# Altium schematic sheet Power.SchDoc
size A3; SheetNumber: 2; SheetTotal: 8; SheetName: Power
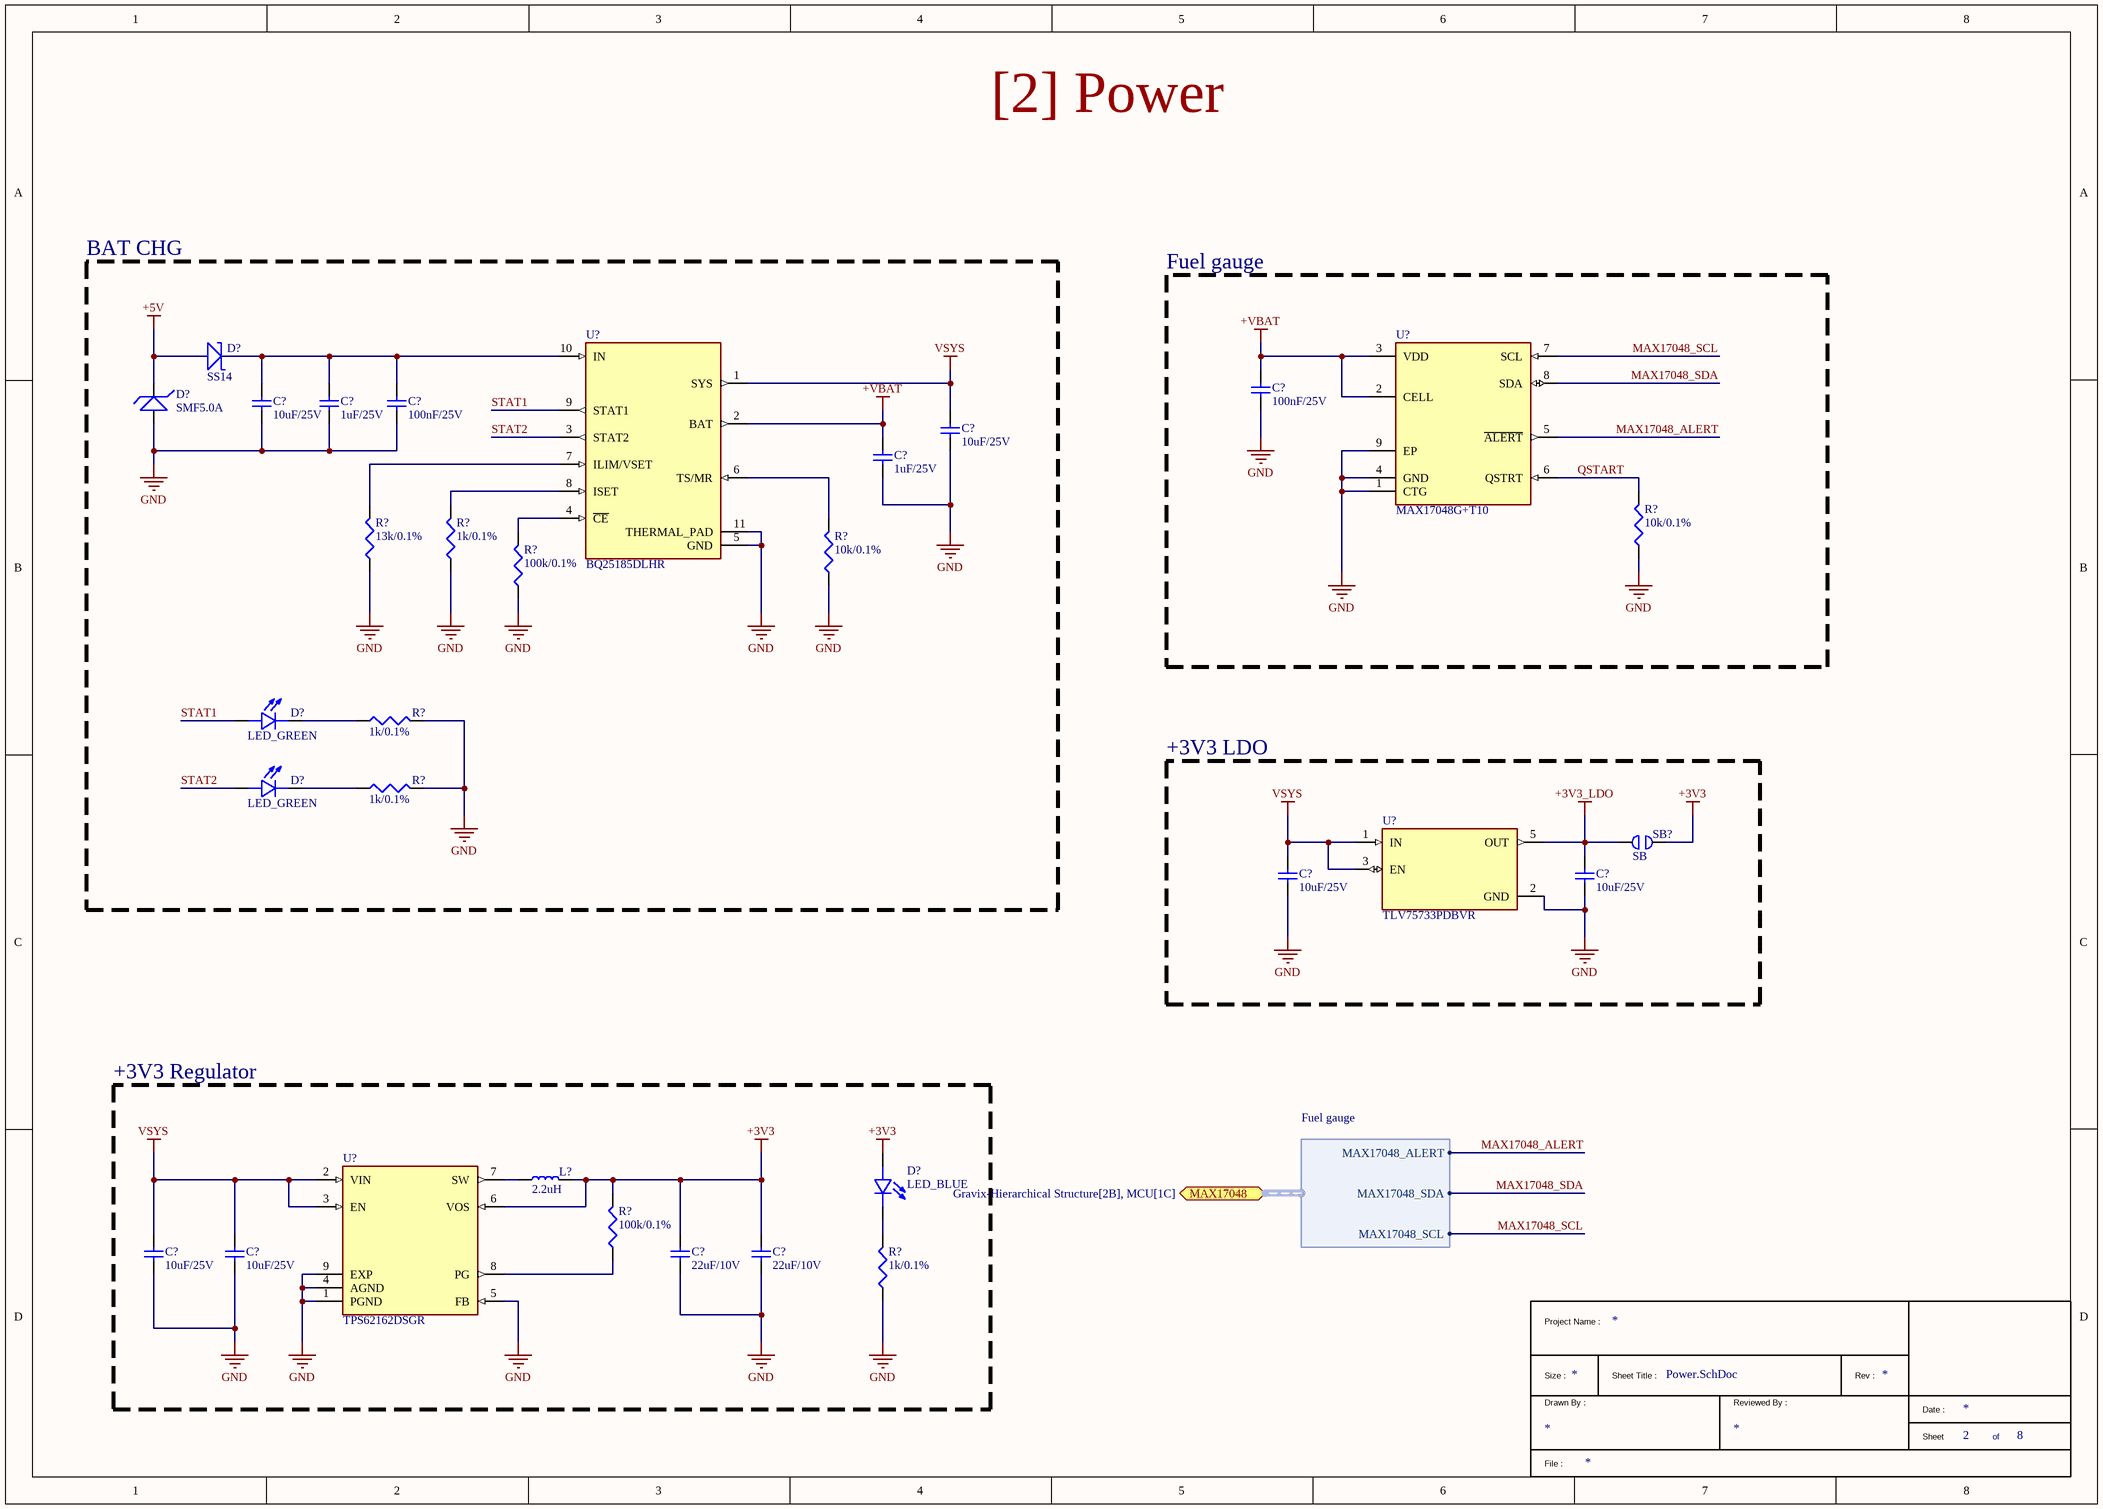
[diagram p0: Power.SchDoc]

## Parts
(Parts that share a designator on the sheet are numbered #1, #2 ... from top to bottom, then left to right.)
*  TitleBlock1  (value not drawn)  (graphical)
C?#1  100nF/25V  [CAP_0402]
C?#2  10uF/25V  [CAP_1206]
C?#3  1uF/25V  [CAP_0805]
C?#4  100nF/25V  [CAP_0402]
C?#5  10uF/25V  [CAP_1206]
C?#6  1uF/25V  [CAP_0805]
C?#7  10uF/25V  [CAP_1206]
C?#8  10uF/25V  [CAP_1206]
C?#9  10uF/25V  [CAP_1206]
C?#10  10uF/25V  [CAP_1206]
C?#11  22uF/10V  [CAP_1206]
C?#12  22uF/10V  [CAP_1206]
D?#1  SS14  [SS14_SMA(DO-214AC)]
D?#2  SMF5.0A  [SMF5.0A_]
D?#3  LED_GREEN  [LED_0402]
D?#4  LED_GREEN  [LED_0402]
D?#5  LED_BLUE  [LED_0402]
L?  2.2uH  [IND_SMD,3x3mm]
R?#1  10k/0.1%  [RES_0402]
R?#2  13k/0.1%  [RES_0402]
R?#3  1k/0.1%  [RES_0402]
R?#4  10k/0.1%  [RES_0402]
R?#5  100k/0.1%  [RES_0402]
R?#6  1k/0.1%  [RES_0402]
R?#7  1k/0.1%  [RES_0402]
R?#8  100k/0.1%  [RES_0402]
R?#9  1k/0.1%  [RES_0402]
SB?  SB  [SLD_2P]
U?#1  MAX17048G+T10  [MAX17048G+T10_TDFN-8]
U?#2  BQ25185DLHR  [BQ25185DLHR_WFDFN-10]
U?#3  TLV75733PDBVR  [TLV75733PDBVR_SOT-23-5]
U?#4  TPS62162DSGR  [TPS62162DSGR_WSON-8-EP(2x2)]

## Blocks framed on the sheet
BAT CHG: C?#2-C?#6 D?#1-D?#4 R?#2-R?#7 U?#2
Fuel gauge: C?#1 R?#1 U?#1
+3V3 LDO: C?#7 C?#8 SB? U?#3
+3V3 Regulator: C?#9-C?#12 D?#5 L? R?#8 R?#9 U?#4

## Ports
MAX17048 (bidir, harness Fuel gauge, see Gravix-Hierarchical Structure[2B], MCU[1C])

## Harnesses
Fuel gauge: MAX17048_SCL, MAX17048_SDA, MAX17048_ALERT

## Nets
+3V3: C?#11.2 C?#12.2 D?#5.A L?.2 R?#8.2 SB?.2 U?#4.6(VOS)
+3V3_LDO: C?#8.2 SB?.1 U?#3.5(OUT)
+5V: D?#1.2
+VBAT: C?#1.2 C?#6.2 U?#1.2(CELL) U?#1.3(VDD) U?#2.2(BAT)
GND: C?#1.1 C?#2.1 C?#3.1 C?#4.1 C?#5.1 C?#6.1 C?#7.1 C?#8.1 C?#9.1 C?#10.1 C?#11.1 C?#12.1 R?#1.1 R?#2.1 R?#3.1 R?#4.1 R?#5.1 R?#6.2 R?#7.2 R?#9.1 U?#1.1(CTG) U?#1.4(GND) U?#1.9(EP) U?#2.5(GND) U?#2.11(THERMAL_PAD) U?#3.2(GND) U?#4.1(PGND) U?#4.4(AGND) U?#4.5(FB) U?#4.9(EXP)
VSYS: C?#5.2 C?#7.2 C?#9.2 C?#10.2 U?#2.1(SYS) U?#3.1(IN) U?#3.3(EN) U?#4.2(VIN) U?#4.3(EN)
MAX17048_ALERT: U?#1.5(~{ALERT}) ; port MAX17048.MAX17048_ALERT
MAX17048_SCL: U?#1.7(SCL) ; port MAX17048.MAX17048_SCL
MAX17048_SDA: U?#1.8(SDA) ; port MAX17048.MAX17048_SDA
QSTART: R?#1.2 U?#1.6(QSTRT)
STAT1: D?#3.A U?#2.9(STAT1)
STAT2: D?#4.A U?#2.3(STAT2)
NetC?#2_2: C?#2.2 C?#3.2 C?#4.2 D?#1.1 U?#2.10(IN)
NetD?#3_C: D?#3.C R?#6.1
NetD?#4_C: D?#4.C R?#7.1
NetD?#5_C: D?#5.C R?#9.2
NetL?_1: L?.1 U?#4.7(SW)
NetR?#2_2: R?#2.2 U?#2.7(ILIM/VSET)
NetR?#3_2: R?#3.2 U?#2.8(ISET)
NetR?#4_2: R?#4.2 U?#2.6(TS/MR)
NetR?#5_2: R?#5.2 U?#2.4(~{CE})
NetR?#8_1: R?#8.1 U?#4.8(PG)

Not connected (* = marked no-connect by the designer): D?#2 1 2

## Notes on the sheet
- [2] Power
- (in symbol TitleBlock1) Project Name :; Size :; Sheet Title :; Rev :; Drawn By :; Reviewed By :; Date :; Sheet; of; File :

## Library data of the parts
C?#1 C?#4 = YAGEO CC0402JRX7R8BB104: 100nF ±5% 25V Ceramic Capacitor X7R 0402; Manufacturer: YAGEO; Manufacturer Part Number: CC0402JRX7R8BB104; LCSC Part Number: C541465; Package: 0402; Mounting Type: SMD; ComponentLink2Description: Digikey Link; ComponentLink3Description: LCSC Link; ComponentLink3URL: https://www.lcsc.com/product-detail/C541465.html?spm=wm.fly.bg.0.xh___wm.fly.dhl.mly.12-0-4&lcsc_vid=QlAIX1RQQQJfX1VRTwcNAQJXTlRaUQBVEQBYAwJfFFcxVlNRQFhYU1xWRFVdXztW
C?#2 C?#5 C?#7-C?#10 = muRata GRM31CR71E106KA12L: 10uF ±10% 25V Ceramic Capacitor X7R 1206; Manufacturer: muRata; Manufacturer Part Number: GRM31CR71E106KA12L; LCSC Part Number: C77093; Package: 1206; Mounting Type: SMD; ComponentLink2Description: Digikey Link; ComponentLink3Description: LCSC Link; ComponentLink3URL: https://www.lcsc.com/product-detail/C77093.html?spm=wm.fly.bg.1.xh___wm.sxq.dhl.mly.12-0-4&lcsc_vid=QlAIX1RQQQJfX1VRTwcNAQJXTlRaUQBVEQBYAwJfFFcxVlNRT1FaUl1VQVZcUDsOAxUeFF5JWBYZEEoKFBINSQcJGk4%3D
C?#3 C?#6 = YAGEO CC0805KKX7R8BB105: 1uF ±10% 25V Ceramic Capacitor X7R 0805; Manufacturer: YAGEO; Manufacturer Part Number: CC0805KKX7R8BB105; LCSC Part Number: C91186; Package: 0805; Mounting Type: SMD; ComponentLink2Description: Digikey Link; ComponentLink3Description: LCSC Link; ComponentLink3URL: https://www.lcsc.com/product-detail/C91186.html?spm=wm.fly.bg.0.xh___wm.fly.dhl.mly.12-0-4&lcsc_vid=QlAIX1RQQQJfX1VRTwcNAQJXTlRaUQBVEQBYAwJfFFcxVlNRT1FbV1FfR1JZUDsOAxUeFF5JWBYZEEoKFBINSQcJGk4dAgUUFAk%3D
C?#11 C?#12 = muRata GRM31CR71A226KE15L: 22uF ±10% 10V Ceramic Capacitor X7R 1206; Manufacturer: muRata; Manufacturer Part Number: GRM31CR71A226KE15L; LCSC Part Number: C91604; Package: 1206; Mounting Type: SMD; ComponentLink2Description: Digikey Link; ComponentLink3Description: LCSC Link; ComponentLink3URL: https://www.lcsc.com/product-detail/C91604.html?s_z=n_q_C91604
D?#1 = onsemi SS14: Diode 40V 1A Surface Mount SMA(DO-214AC); Manufacturer: onsemi; Manufacturer Part Number: SS14; LCSC Part Number: C83852; Package: SMA(DO-214AC); Mounting Type: SMD; ComponentLink2Description: Digikey Link; ComponentLink3Description: LCSC Link; ComponentLink3URL: https://www.lcsc.com/product-detail/C83852.html?s_z=n_q_x_SS14&spm=wm.ssy.em.2.tz&lcsc_vid=TgRYXlMEFQVcUQVUT1hcVlJUQ1MPAlRVQVBcVABeFAUxVlNRT1RZVFVUQVBXUTsOAxUeFF5JWBYZEEoKFBINSQcJGk4eFQsCAgIaSgADAwAHC0slRVVWV0oOAwwC
D?#2 = Littelfuse SMF5.0A: 9.2VC Clamp 21.7A Ipp TVS DIODE SOD-123FL; Manufacturer: Littelfuse; Manufacturer Part Number: SMF5.0A; LCSC Part Number: C151296; Package: SOD-123FL; Mounting Type: SMD; ComponentLink2Description: Digikey Link; ComponentLink3Description: LCSC Link; ComponentLink3URL: https://www.lcsc.com/product-detail/C151296.html?s_z=n_q_SMF5.0A&spm=wm.fly.bg.0.xh&lcsc_vid=TgRYXlMEFQVcUQVUT1hcVlJUQ1MPAlRVQVBcVABeFAUxVlNRT1RZVFRUQ1NdUTsOAxUeFF5JWBYZEEoKFBINSQcJGk4eFQsCAgIaSgADAwAHC0slQFRfXkoOAwwC
D?#3 D?#4 = LED_GREEN: Green 520nm LED Indication - Discrete 2.8V 0402; Manufacturer: BrtLed; Manufacturer Part Number: BL-HGK37A-AV-TRB; LCSC Part Number: C5123485; Package: 0402; ComponentLink1Description: Digikey Link; ComponentLink2Description: LCSC Link; ComponentLink2URL: https://www.lcsc.com/product-detail/C5123485.html?s_z=n_q_t_led&spm=wm.fly.bg.0.xh___wm.ssy.tc.0.tz&lcsc_vid=QlAIX1RQQQJfX1VRTwcNAQJXTlRaUQBVEQBYAwJfFFcxVlNRT1RWVlJfRFhYUjsOAxUeFF5JWBYZEEoKFBINSQcJGk4eFQsCAgIaSgADAwAHC0slRlZXU1VSWQkaCgg%3D; Mounting Type: SMD
D?#5 = LED_BLUE: Blue 468nm LED Indication - Discrete 2.8V 0402; Manufacturer: VISHAY; Manufacturer Part Number: VLMB1500-GS08; LCSC Part Number: C511042; Package: 0402; ComponentLink1Description: Digikey Link; ComponentLink2Description: LCSC Link; ComponentLink2URL: https://www.lcsc.com/product-detail/C511042.html?s_z=n_q_t_led&spm=wm.fly.bg.0.xh___wm.ssy.tc.0.tz&lcsc_vid=QlAIX1RQQQJfX1VRTwcNAQJXTlRaUQBVEQBYAwJfFFcxVlNRT1RWVlJfRFhYUjsOAxUeFF5JWBYZEEoKFBINSQcJGk4eFQsCAgIaSgADAwAHC0slRlZXU1VSWQkaCgg%3D; Mounting Type: SMD
L? = Coilcraft XFL3012-222MEC: 1.9A 2.2uH ±20% 97mΩ 1.6A Magnetic Shielded Inductor SMD,3x3mm Fixed Inductors RoHS; Manufacturer: Coilcraft; Manufacturer Part Number: XFL3012-222MEC; LCSC Part Number: C3911432; Package: SMD,3x3mm; ComponentLink1Description: Digikey Link; Mounting Type: SMD; ComponentLink2Description: LCSC Link; ComponentLink2URL: https://www.lcsc.com/product-detail/C3911432.html?s_z=n_q_XFL3012-222MEC&spm=wm.ssy.bg.0.xh&lcsc_vid=QlAIX1RQQQJfX1VRTwcNAQJXTlRaUQBVEQBYAwJfFFcxVlNRT1FaUl1VQVZcUDsOAxUeFF5JWBYZEEoKFBINSQcJGk4%3D
R?#1 R?#4 = YAGEO RT0402BRD0710KL: 62.5mW 10kΩ 50V Thin Film Resistor ±25ppm/℃ ±0.1% 0402 Chip Resistor - Surface Mount RoHS; Manufacturer: YAGEO; Manufacturer Part Number: RT0402BRD0710KL; LCSC Part Number: C190095; Package: 0402; ComponentLink1Description: Digikey Link; Mounting Type: SMD; ComponentLink2Description: LCSC Link; ComponentLink2URL: https://www.lcsc.com/product-detail/C190095.html?spm=wm.fly.bg.0.xh___wm.fly.dhl.mly.12-6-1&lcsc_vid=QlAIX1RQQQJfX1VRTwcNAQJXTlRaUQBVEQBYAwJfFFcxVlNRT1FbV1FfR1JZUDsOAxUeFF5JWBYZEEoKFBINSQcJGk4dAgUUFAk%3D
R?#2 = YAGEO RT0402BRD0713KL: 62.5mW 13kΩ 50V Thin Film Resistor ±25ppm/℃ ±0.1% 0402 Chip Resistor - Surface Mount RoHS; Manufacturer: YAGEO; Manufacturer Part Number: RT0402BRD0713KL; LCSC Part Number: C852524; Package: 0402; ComponentLink1Description: Digikey Link; Mounting Type: SMD; ComponentLink2Description: LCSC Link; ComponentLink2URL: https://www.lcsc.com/product-detail/C852524.html?spm=wm.fly.bg.0.xh___wm.sxq.dhl.mly.12-6-1&lcsc_vid=QlAIX1RQQQJfX1VRTwcNAQJXTlRaUQBVEQBYAwJfFFcxVlNRT1FbV1FfR1JZUDsOAxUeFF5JWBYZEEoKFBINSQcJGk4dAgUUFAk%3D
R?#3 R?#6 R?#7 R?#9 = YAGEO RT0402BRD071KL: 1kΩ 62.5mW 50V Thin Film Resistor ±25ppm/℃ ±0.1% 0402 Chip Resistor - Surface Mount RoHS; Manufacturer: YAGEO; Manufacturer Part Number: RT0402BRD071KL; LCSC Part Number: C852624; Package: 0402; ComponentLink1Description: Digikey Link; Mounting Type: SMD; ComponentLink2Description: LCSC Link; ComponentLink2URL: https://www.lcsc.com/product-detail/C852624.html?spm=wm.fly.bg.0.xh___wm.sxq.dhl.mly.12-6-1&lcsc_vid=QlAIX1RQQQJfX1VRTwcNAQJXTlRaUQBVEQBYAwJfFFcxVlNRT1FbV1FfR1JZUDsOAxUeFF5JWBYZEEoKFBINSQcJGk4dAgUUFAk%3D
R?#5 R?#8 = YAGEO RT0402BRD07100KL: 100kΩ 62.5mW 50V Thin Film Resistor ±25ppm/℃ ±0.1% 0402 Chip Resistor - Surface Mount RoHS; Manufacturer: YAGEO; Manufacturer Part Number: RT0402BRD07100KL; LCSC Part Number: C852472; Package: 0402; ComponentLink1Description: Digikey Link; Mounting Type: SMD; ComponentLink2Description: LCSC Link; ComponentLink2URL: https://www.lcsc.com/product-detail/C852472.html?spm=wm.fly.bg.0.xh___wm.fly.dhl.mly.12-6-1&lcsc_vid=QlAIX1RQQQJfX1VRTwcNAQJXTlRaUQBVEQBYAwJfFFcxVlNRT1FbV1FfR1JZUDsOAxUeFF5JWBYZEEoKFBINSQcJGk4dAgUUFAk%3D
SB? = SLD_2P
U?#1 = MAXIM MAX17048G+T10: Lithium Battery I2C DFN-8-EP(2x2) Battery Management RoHS; Manufacturer: MAXIM; Manufacturer Part Number: MAX17048G+T10; LCSC Part Number: C2682616; Package: DFN-8-EP(2x2); Mounting Type: SMD; ComponentLink2Description: Digikey Link; ComponentLink3Description: LCSC Link; ComponentLink3URL: https://www.lcsc.com/product-detail/C2682616.html?s_z=n_q_C2682616
U?#2 = TI BQ25185DLHR: 1-Cell, 1-A Standalone Linear Battery Charger with PowerPath, Factory Mode, and Battery Tracking VINDPM; Manufacturer: TI; Manufacturer Part Number: BQ25185DLHR; LCSC Part Number: C19725033; Package: WSON-10-EP(2.2x2); Mounting Type: SMD; ComponentLink2Description: Digikey Link; ComponentLink3Description: LCSC Link; ComponentLink3URL: https://www.lcsc.com/product-detail/C19725033.html?s_z=n_q_C19725033
U?#3 = TI TLV75733PDBVR: 3.3V Positive Fixed SOT-23-5 Voltage Regulators - Linear, Low Drop Out (LDO) Regulators RoHS; Manufacturer: TI; Manufacturer Part Number: TLV75733PDBVR; LCSC Part Number: C485517; Package: SOT-23-5; Mounting Type: SMD; ComponentLink2Description: Digikey Link; ComponentLink3Description: LCSC Link; ComponentLink3URL: https://www.lcsc.com/product-detail/C485517.html?spm=wm.fly.bg.0.xh&lcsc_vid=QlAIX1RQQQJfX1VRTwcNAQJXTlRaUQBVEQBYAwJfFFcxVlNRT1FbV1FfR1JZUDsOAxUeFF5JWBYZEEoKFBINSQcJGk4dAgUUFAk%3D
U?#4 = TI TPS62162DSGR: 2.25MHz Step-down type Fixed 3.3V 1A WSON-8-EP(2x2) Voltage Regulators - DC DC Switching Regulators RoHS; Manufacturer: TI; Manufacturer Part Number: TPS62162DSGR; LCSC Part Number: C40256; Package: WSON-8-EP(2x2); Mounting Type: SMD; ComponentLink2Description: Digikey Link; ComponentLink3Description: LCSC Link; ComponentLink3URL: https://www.lcsc.com/product-detail/C40256.html?s_z=n_q_TPS62162&spm=wm.ssy.bg.0.xh&lcsc_vid=QlAIX1RQQQJfX1VRTwcNAQJXTlRaUQBVEQBYAwJfFFcxVlNRQFhXUFJST1hcUTsOAxUeFF5JWBYZEEoKFBINSQcJGk4%3D